# EAGLE design T2E (EAGLE 9.6.2)
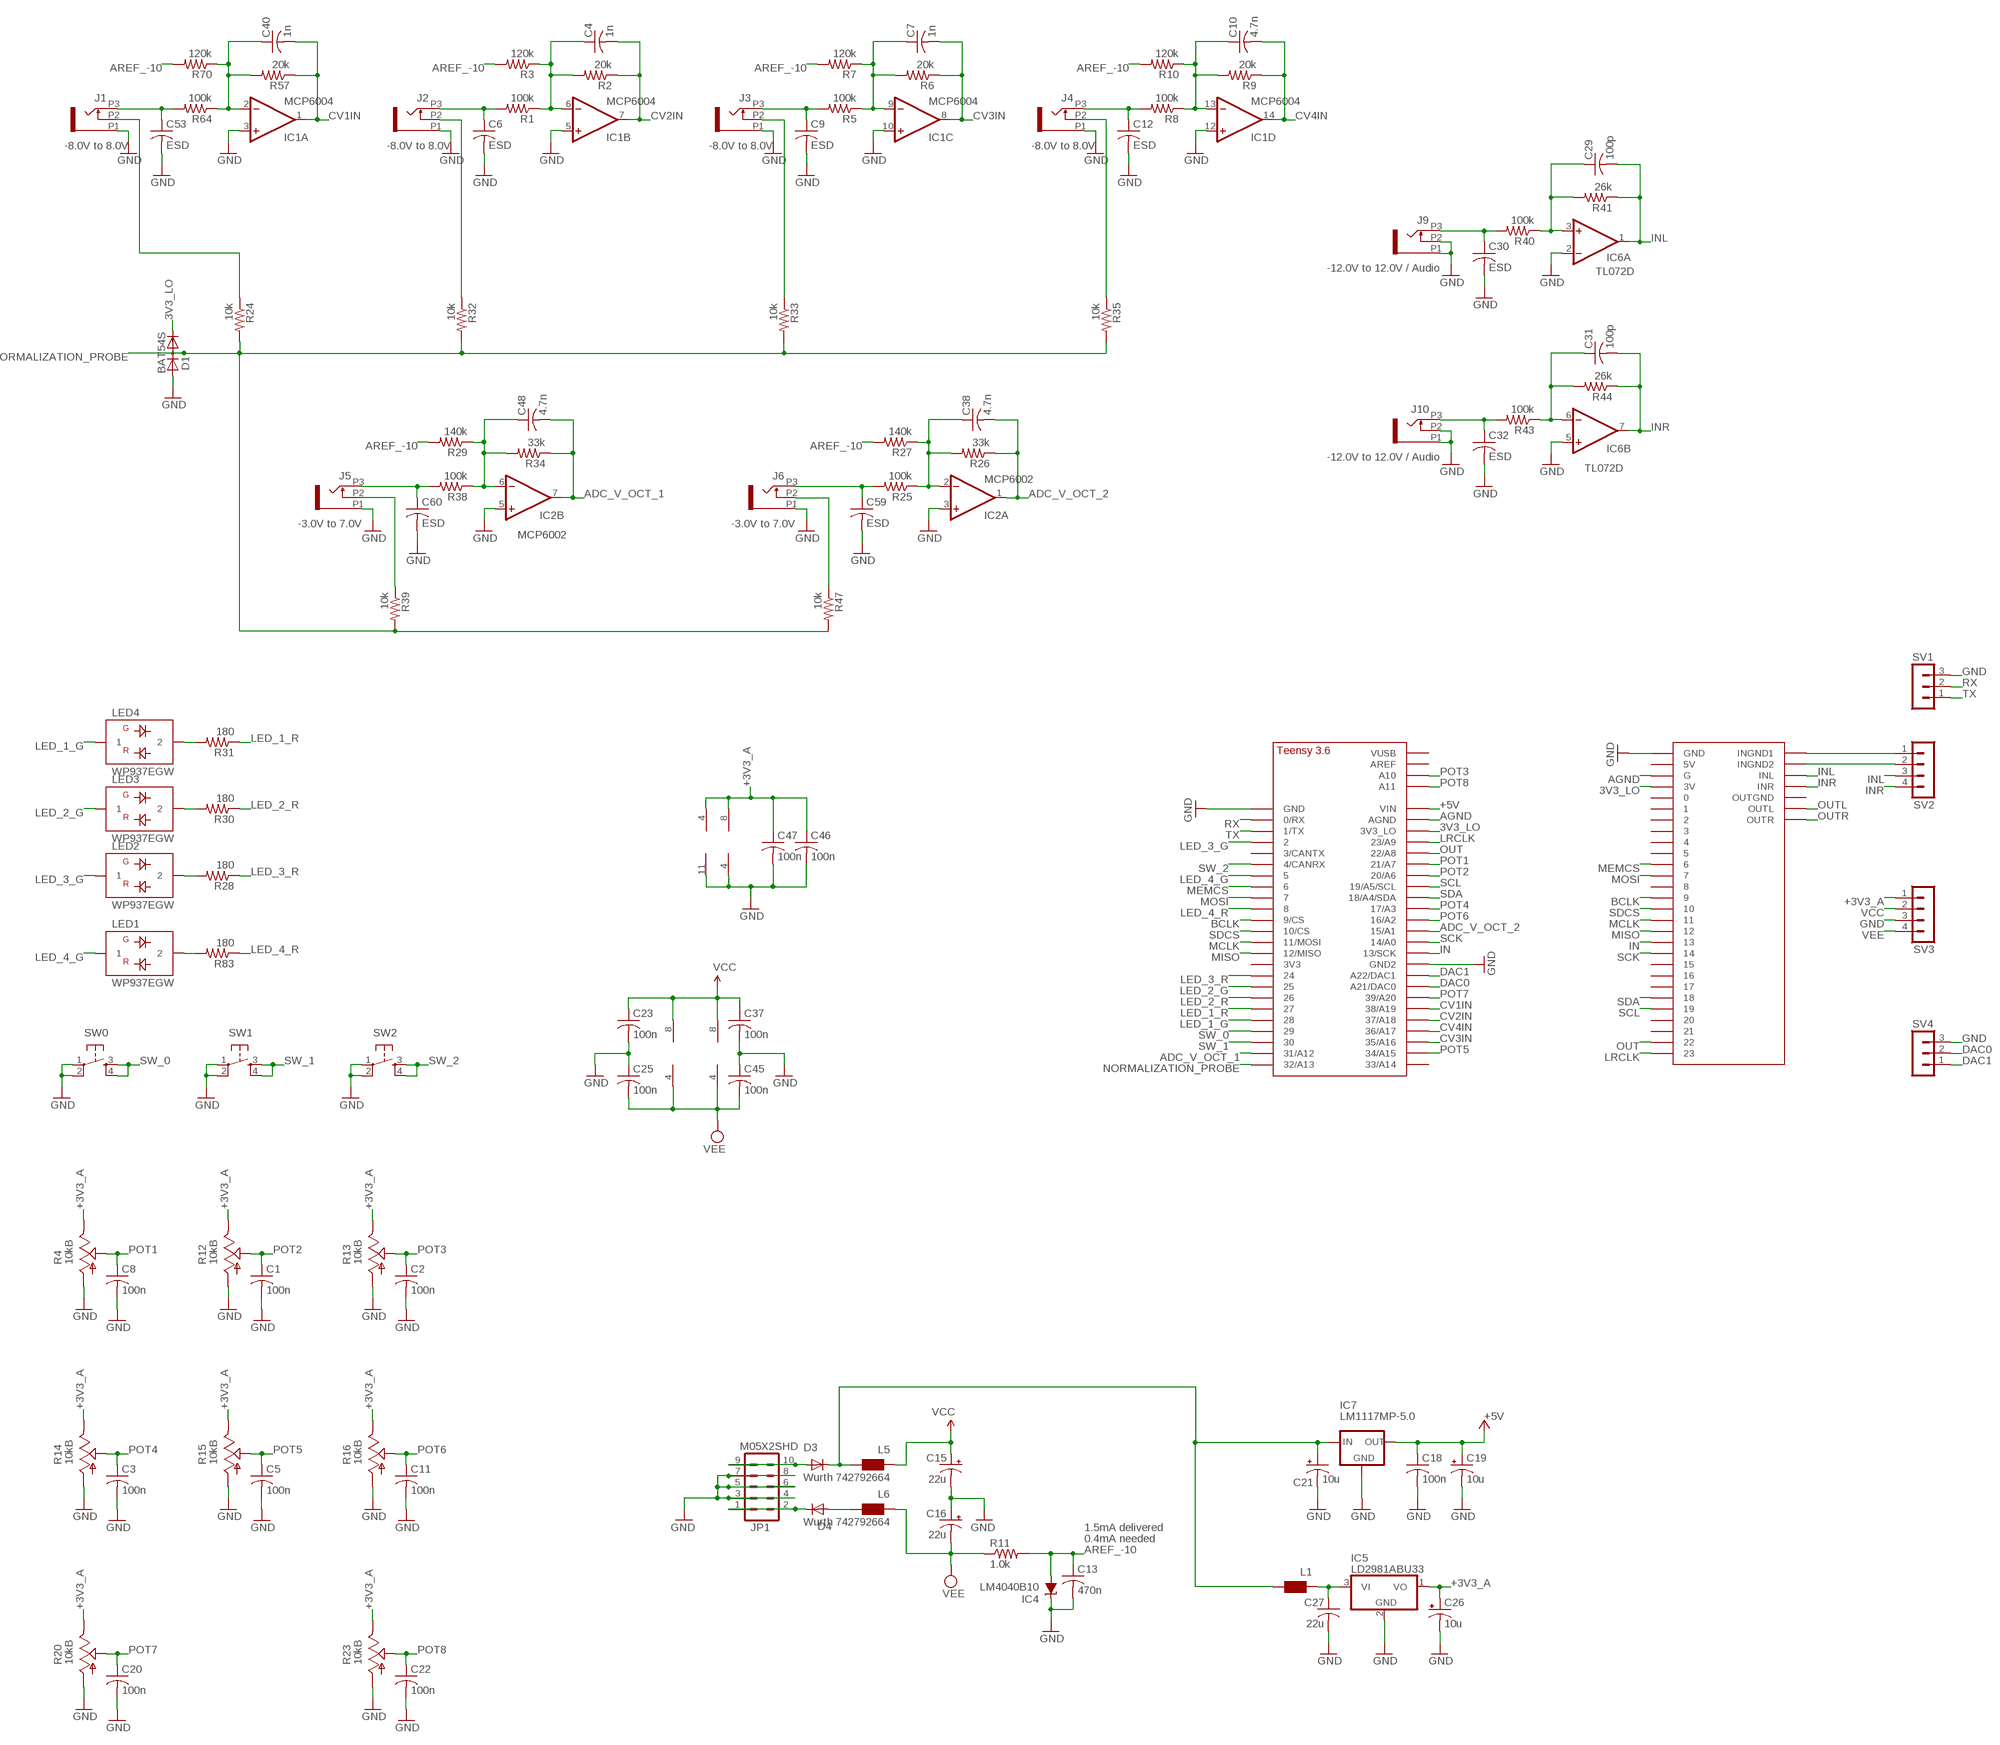
[diagram p0: schematic, sheet 1, part 1 of 2]
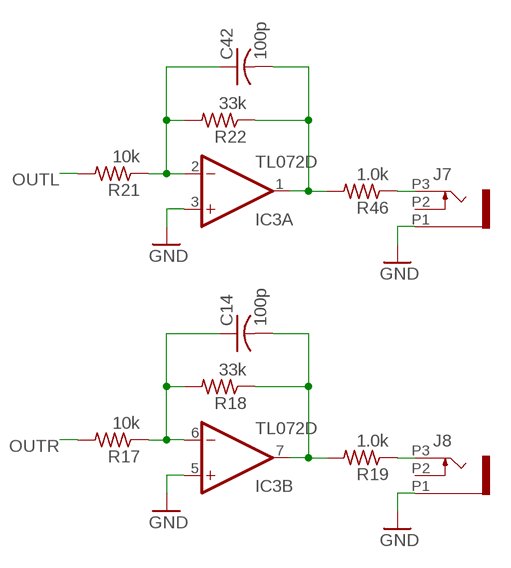
[diagram p1: schematic, sheet 1, part 2 of 2]

## Parts
C1  100n  C-USC0603  [C0603]
C2  100n  C-USC0603  [C0603]
C3  100n  C-USC0603  [C0603]
C4  1n  C-USC0603  [C0603]
C5  100n  C-USC0603  [C0603]
C6  ESD  C-USC0603  [C0603]
C7  1n  C-USC0603  [C0603]
C8  100n  C-USC0603  [C0603]
C9  ESD  C-USC0603  [C0603]
C10  4.7n  C-USC0603  [C0603]
C11  100n  C-USC0603  [C0603]
C12  ESD  C-USC0603  [C0603]
C13  470n  C-USC0603  [C0603]
C14  100p  C-USC0603  [C0603]
C15  22u  CPOL-USC  [PANASONIC_C]
C16  22u  CPOL-USC  [PANASONIC_C]
C18  100n  C-USC0603  [C0603]
C19  10u  CPOL-USC  [PANASONIC_C]
C20  100n  C-USC0603  [C0603]
C21  10u  CPOL-USC  [PANASONIC_C]
C22  100n  C-USC0603  [C0603]
C23  100n  C-USC0603  [C0603]
C25  100n  C-USC0603  [C0603]
C26  10u  CPOL-USA  [PANASONIC_A]
C27  22u  C-USC1206  [C1206]
C29  100p  C-USC0603  [C0603]
C30  ESD  C-USC0603  [C0603]
C31  100p  C-USC0603  [C0603]
C32  ESD  C-USC0603  [C0603]
C37  100n  C-USC0603  [C0603]
C38  4.7n  C-USC0603  [C0603]
C40  1n  C-USC0603  [C0603]
C42  100p  C-USC0603  [C0603]
C45  100n  C-USC0603  [C0603]
C46  100n  C-USC0603  [C0603]
C47  100n  C-USC0603  [C0603]
C48  4.7n  C-USC0603  [C0603]
C53  ESD  C-USC0603  [C0603]
C59  ESD  C-USC0603  [C0603]
C60  ESD  C-USC0603  [C0603]
D1  BAT54S  DIODE_2CACA-SOT23  [SOT23]
D3  1N5819HW  DIODE-SOD123  [SOD123]
D4  1N5819HW  DIODE-SOD123  [SOD123]
IC1  MCP6004  TL074D  [SO14]
IC2  MCP6002  TL072D  [SO08]
IC3  TL072D  [SO08]
IC4  LM4040B10  LM4041B12DBZ  [DBZ_R-PDSO-G3]
IC5  LD2981ABU33  LD2981ABU  [SOT89]
IC6  TL072D  [SO08]
IC7  LM1117MP-5.0  [SOT223]
J1  PJ301_THONKICONN6  [WQP_PJ_301M6]
J2  PJ301_THONKICONN6  [WQP_PJ_301M6]
J3  PJ301_THONKICONN6  [WQP_PJ_301M6]
J4  PJ301_THONKICONN6  [WQP_PJ_301M6]
J5  PJ301_THONKICONN6  [WQP_PJ_301M6]
J6  PJ301_THONKICONN6  [WQP_PJ_301M6]
J7  PJ301_THONKICONN6  [WQP_PJ_301M6]
J8  PJ301_THONKICONN6  [WQP_PJ_301M6]
J9  PJ301_THONKICONN6  [WQP_PJ_301M6]
J10  PJ301_THONKICONN6  [WQP_PJ_301M6]
JP1  M05X2SHD  [2X5-SHROUDED]
L1  WE-CBF_0603  [0603]
L5  Wurth 742792664  WE-CBF_0603  [0603]
L6  Wurth 742792664  WE-CBF_0603  [0603]
LED1  WP937EGW  LED-BICOLOR-SHARED-THROUGHHOLE  [LED3MM]
LED2  WP937EGW  LED-BICOLOR-SHARED-THROUGHHOLE  [LED3MM]
LED3  WP937EGW  LED-BICOLOR-SHARED-THROUGHHOLE  [LED3MM]
LED4  WP937EGW  LED-BICOLOR-SHARED-THROUGHHOLE  [LED3MM]
R1  100k  R-US_R0603  [R0603]
R2  20k  R-US_R0603  [R0603]
R3  120k  R-US_R0603  [R0603]
R4  10kB  POT_USVERTICAL_PS  [ALPS_POT_VERTICAL_PS]
R5  100k  R-US_R0603  [R0603]
R6  20k  R-US_R0603  [R0603]
R7  120k  R-US_R0603  [R0603]
R8  100k  R-US_R0603  [R0603]
R9  20k  R-US_R0603  [R0603]
R10  120k  R-US_R0603  [R0603]
R11  1.0k  R-US_R0603  [R0603]
R12  10kB  POT_USVERTICAL_PS  [ALPS_POT_VERTICAL_PS]
R13  10kB  POT_USVERTICAL_PS  [ALPS_POT_VERTICAL_PS]
R14  10kB  POT_USVERTICAL_PS  [ALPS_POT_VERTICAL_PS]
R15  10kB  POT_USVERTICAL_PS  [ALPS_POT_VERTICAL_PS]
R16  10kB  POT_USVERTICAL_PS  [ALPS_POT_VERTICAL_PS]
R17  10k  R-US_R0603  [R0603]
R18  33k  R-US_R0603  [R0603]
R19  1.0k  R-US_R0603  [R0603]
R20  10kB  POT_USVERTICAL_PS  [ALPS_POT_VERTICAL_PS]
R21  10k  R-US_R0603  [R0603]
R22  33k  R-US_R0603  [R0603]
R23  10kB  POT_USVERTICAL_PS  [ALPS_POT_VERTICAL_PS]
R24  10k  R-US_R0603  [R0603]
R25  100k  R-US_R0603  [R0603]
R26  33k  R-US_R0603  [R0603]
R27  140k  R-US_R0603  [R0603]
R28  180  R-US_R0603  [R0603]
R29  140k  R-US_R0603  [R0603]
R30  180  R-US_R0603  [R0603]
R31  180  R-US_R0603  [R0603]
R32  10k  R-US_R0603  [R0603]
R33  10k  R-US_R0603  [R0603]
R34  33k  R-US_R0603  [R0603]
R35  10k  R-US_R0603  [R0603]
R38  100k  R-US_R0603  [R0603]
R39  10k  R-US_R0603  [R0603]
R40  100k  R-US_R0603  [R0603]
R41  26k  R-US_R0603  [R0603]
R43  100k  R-US_R0603  [R0603]
R44  26k  R-US_R0603  [R0603]
R46  1.0k  R-US_R0603  [R0603]
R47  10k  R-US_R0603  [R0603]
R57  20k  R-US_R0603  [R0603]
R64  100k  R-US_R0603  [R0603]
R70  120k  R-US_R0603  [R0603]
R83  180  R-US_R0603  [R0603]
SV1  MA03-1  [MA03-1]
SV2  MA04-1  [MA04-1]
SV3  MA04-1  [MA04-1]
SV4  MA03-1  [MA03-1]
SW0  TAC_SWITCHPTH  [TACTILE-PTH]
SW1  TAC_SWITCHPTH  [TACTILE-PTH]
SW2  TAC_SWITCHPTH  [TACTILE-PTH]
U$1  TeensyAudioShield Rev C.  AUDIOSHIELD  [AUDIOSHIELD]
U$4  TEENSY_3.5/3.6_BASIC  [TEENSY_3.5/3.6_BASIC]

## Nets
3V3_LO: D1.2(C) U$1.3V U$4.3V3_LO
+3V3_A [Supply]: C26.+ C46.1 C47.1 IC1.4(P:V+) IC2.8(P:V+) IC5.1(VO) R4.P$1(E) R12.P$1(E) R13.P$1(E) R14.P$1(E) R15.P$1(E) R16.P$1(E) R20.P$1(E) R23.P$1(E) SV3.1
+5V [Supply]: C18.1 C19.+ IC7.2(OUT) IC7.4(OUT) U$4.VIN
ADC_V_OCT_1: C48.2 IC2.7(B:OUT) R34.1 U$4.31/A12
ADC_V_OCT_2: C38.2 IC2.1(A:OUT) R26.1 U$4.15/A1
AGND: U$1.G U$4.AGND
AREF_-10: C13.1 IC4.2(A) R3.2 R7.2 R10.2 R11.2 R27.2 R29.2 R70.2
BCLK: U$1.9 U$4.9/CS
CV1IN: C40.2 IC1.1(A:OUT) R57.1 U$4.38/A19
CV2IN: C4.2 IC1.7(B:OUT) R2.1 U$4.37/A18
CV3IN: C7.2 IC1.8(C:OUT) R6.1 U$4.35/A16
CV4IN: C10.2 IC1.14(D:OUT) R9.1 U$4.36/A17
DAC0: SV4.2 U$4.21/DAC0(A21/DAC0)
DAC1: SV4.1 U$4.A22/DAC1
GATE_IN1: C59.1 J6.P3 R25.2
GND [Supply]: C1.2 C2.2 C3.2 C5.2 C6.2 C8.2 C9.2 C11.2 C12.2 C13.2 C15.- C16.+ C18.2 C19.- C20.2 C21.- C22.2 C23.2 C25.1 C26.- C27.2 C30.2 C32.2 C37.2 C45.1 C46.2 C47.2 C53.2 C59.2 C60.2 D1.1(A) IC1.3(A:+IN) IC1.5(B:+IN) IC1.10(C:+IN) IC1.11(P:V-) IC1.12(D:+IN) IC2.3(A:+IN) IC2.4(P:V-) IC2.5(B:+IN) IC3.3(A:+IN) IC3.5(B:+IN) IC4.1(C) IC5.2(GND) IC6.2(A:-IN) IC6.5(B:+IN) IC7.1(GND) J1.P1 J2.P1 J3.P1 J4.P1 J5.P1 J6.P1 J7.P1 J8.P1 J9.P1 J9.P2 J10.P1 J10.P2 JP1.3 JP1.4 JP1.5 JP1.6 JP1.7 JP1.8 R4.P$3(A) R12.P$3(A) R13.P$3(A) R14.P$3(A) R15.P$3(A) R16.P$3(A) R20.P$3(A) R23.P$3(A) SV1.3 SV3.3 SV4.3 SW0.1 SW0.2 SW1.1 SW1.2 SW2.1 SW2.2 U$1.GND U$4.GND U$4.GND2
IN: U$1.13 U$4.13/SCK
INL: C29.2 IC6.1(A:OUT) R41.1 SV2.3 U$1.INL
INR: C31.2 IC6.7(B:OUT) R44.1 SV2.4 U$1.INR
LED_1_G: LED4.1 U$4.28
LED_1_R: R31.1 U$4.27
LED_2_G: LED3.1 U$4.25
LED_2_R: R30.1 U$4.26
LED_3_G: LED2.1 U$4.2
LED_3_R: R28.1 U$4.24
LED_4_G: LED1.1 U$4.5
LED_4_R: R83.1 U$4.8
LRCLK: U$1.23 U$4.23/A9
MCLK: U$1.11 U$4.11/MOSI
MEMCS: U$1.6 U$4.6
MISO: U$1.12 U$4.12/MISO
MORPH_IN: C53.1 J1.P3 R64.2
MORPH_IN1: C6.1 J2.P3 R1.2
MORPH_IN2: C9.1 J3.P3 R5.2
MORPH_IN3: C12.1 J4.P3 R8.2
MORPH_IN4: C30.1 J9.P3 R40.2
MORPH_IN5: C32.1 J10.P3 R43.2
MOSI: U$1.7 U$4.7
N$1: C4.1 IC1.6(B:-IN) R1.1 R2.2 R3.1
N$2: C7.1 IC1.9(C:-IN) R5.1 R6.2 R7.1
N$3: C10.1 IC1.13(D:-IN) R8.1 R9.2 R10.1
N$4: C14.1 IC3.6(B:-IN) R17.1 R18.2
N$5 [Supply]: D3.A JP1.9 JP1.10
N$6: C14.2 IC3.7(B:OUT) R18.1 R19.2
N$7 [Supply]: D4.C JP1.1 JP1.2
N$8: J8.P3 R19.1
N$10: SV2.1 U$1.INGND1
N$11: C40.1 IC1.2(A:-IN) R57.2 R64.1 R70.1
N$12 [Supply]: D4.A L6.2
N$14: C38.1 IC2.2(A:-IN) R25.1 R26.2 R27.1
N$15: SV2.2 U$1.INGND2
N$16: C29.1 IC6.3(A:+IN) R40.1 R41.2
N$17: LED2.2 R28.2
N$18 [Supply]: J5.P2 R39.1
N$19: LED3.2 R30.2
N$20: LED4.2 R31.2
N$21: C31.1 IC6.6(B:-IN) R43.1 R44.2
N$24 [Supply]: J3.P2 R33.1
N$25: J2.P2 R32.1
N$26: J1.P2 R24.1
N$27 [Supply]: J4.P2 R35.1
N$30: C48.1 IC2.6(B:-IN) R29.1 R34.2 R38.1
N$31 [Supply]: J6.P2 R47.1
N$40: C21.+ D3.C IC7.3(IN) L1.2 L5.2
N$42: C27.1 IC5.3(VI) L1.1
N$44: LED1.2 R83.2
N$62: C42.1 IC3.2(A:-IN) R21.1 R22.2
N$63: C42.2 IC3.1(A:OUT) R22.1 R46.2
N$65: J7.P3 R46.1
NORMALIZATION_PROBE: D1.3(AC) R24.2 R32.2 R33.2 R35.2 R39.2 R47.2 U$4.32/A13
OUT: U$1.22 U$4.22/A8
OUTL: R21.2 U$1.OUTL
OUTR: R17.2 U$1.OUTR
POT1: C8.1 R4.P$2(S) U$4.21/A7
POT2: C1.1 R12.P$2(S) U$4.20/A6
POT3: C2.1 R13.P$2(S) U$4.A10
POT4: C3.1 R14.P$2(S) U$4.17/A3
POT5: C5.1 R15.P$2(S) U$4.34/A15
POT6: C11.1 R16.P$2(S) U$4.16/A2
POT7: C20.1 R20.P$2(S) U$4.39/A20
POT8: C22.1 R23.P$2(S) U$4.A11
RX: SV1.2 U$4.0/RX
SCK: U$1.14 U$4.14/A0
SCL: U$1.19 U$4.19/A5/SCL
SDA: U$1.18 U$4.18/A4/SDA
SDCS: U$1.10 U$4.10/CS
SW_0: SW0.3 SW0.4 U$4.29
SW_1: SW1.3 SW1.4 U$4.30
SW_2: SW2.3 SW2.4 U$4.4/CANRX
TX: SV1.1 U$4.1/TX
V_OCT_IN: C60.1 J5.P3 R38.2
VCC [Supply]: C15.+ C23.1 C37.1 IC3.8(P:V+) IC6.8(P:V+) L5.1 SV3.2
VEE [Supply]: C16.- C25.2 C45.2 IC3.4(P:V-) IC6.4(P:V-) L6.1 R11.1 SV3.4
Unconnected: J7.P2 J8.P2 U$1.0 U$1.1 U$1.2 U$1.3 U$1.4 U$1.5 U$1.5V U$1.8 U$1.15 U$1.16 U$1.17 U$1.20 U$1.21 U$1.OUTGND U$4.3/CANTX U$4.3V3 U$4.33/A14 U$4.AREF U$4.VUSB

## Notes on the sheet
- -8.0V to 8.0V | -8.0V to 8.0V | -8.0V to 8.0V | -8.0V to 8.0V
- -12.0V to 12.0V / Audio
- -12.0V to 12.0V / Audio
- -3.0V to 7.0V | -3.0V to 7.0V
- 1.5mA delivered
- 0.4mA needed

## Library data of the parts
C1-C14 C18 C20 C22 C23 C25 C27 C29-C32 C37 C38 C40 C42 C45-C48 C53 C59 C60 = rcl:C-US: CAPACITOR, American symbol
C15 C16 C19 C21 C26 = rcl:CPOL-US: POLARIZED CAPACITOR, American symbol
D1 = diode:DIODE_2CACA-: 2 Diodes - Cathode-Anode|Cathode-Anode
D3 D4 = diode:DIODE-: DIODE
IC1 = og-linear:TL074: OP AMP
IC2 IC3 IC6 = og-linear:TL072: OP AMP
IC4 = texas:LM4041: PRECISION MICROPOWER SHUNT VOLTAGE REFERENCE Source: http://focus.ti.com/lit/ds/slcs146e/slcs146e.pdf
IC5 = og-vreg:LD2981
IC7 = lm1117:LM1117?-*: 800mA Low-Dropout Linear Regulator Source: http://ww1.microchip.com/downloads/en/DeviceDoc/39760d.pdf; MF: Texas Instruments; MPN: LM1117MP-5.0; OC_FARNELL: 9778209; OC_NEWARK: 28X3417
J1-J4 J9 J10 = og-pj301:PJ301_THONKICONN
J5-J8 = og-pj301_variations:PJ301_THONKICONN
JP1 = og-header:M05X2: Header 5x2 Standard 10-pin dual row 0.1" header. Commonly used with AVR-ISP. Use with Spark Fun Electronics SKU: PRT-00778
L1 L5 L6 = wuerth-elektronik:WE-CBF: SMD EMI Suppression Ferrite Beads - excellent anti-EMI properties - low DCR - impedances till 3000 ohms - rated current up to 6 A
LED1-LED4 = og-leds:LED-BICOLOR-SHARED-THROUGHHOLE
R1-R3 R5-R11 R17-R19 R21 R22 R24-R35 R38-R41 R43 R44 R46 R47 R57 R64 R70 R83 = rcl:R-US_: RESISTOR, American symbol
R4 R12-R16 R20 R23 = og-pots:POT_US
SV1 SV4 = con-lstb:MA03-1: PIN HEADER; OC_FARNELL: unknown; OC_NEWARK: unknown
SV2 SV3 = con-lstb:MA04-1: PIN HEADER; OC_FARNELL: unknown; OC_NEWARK: unknown
SW0 SW1 SW2 = SparkFun:TAC_SWITCH: Momentary Switch Button commonly used for reset or general input. Spark Fun Electronics SKU : COM-00097
U$1 = Teensy_Audioshield:AUDIOSHIELD: Teensy 3 Audioshield by PJRC.COM
U$4 = Teensy356:TEENSY_3.5/3.6_BASIC

## Net classes
0 default: width 0.203 mm, clearance 0.203 mm
1 Supply: width 0.406 mm, clearance 0.203 mm

## Board
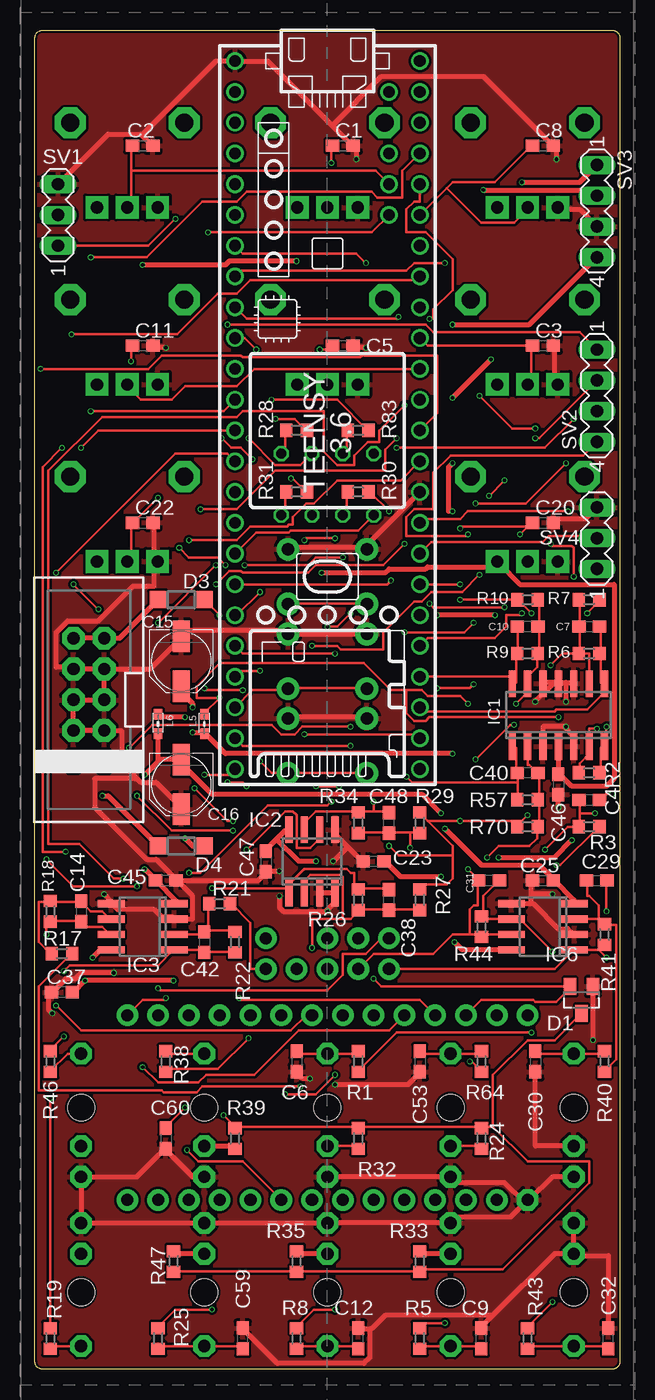
[diagram p2: board, top side]
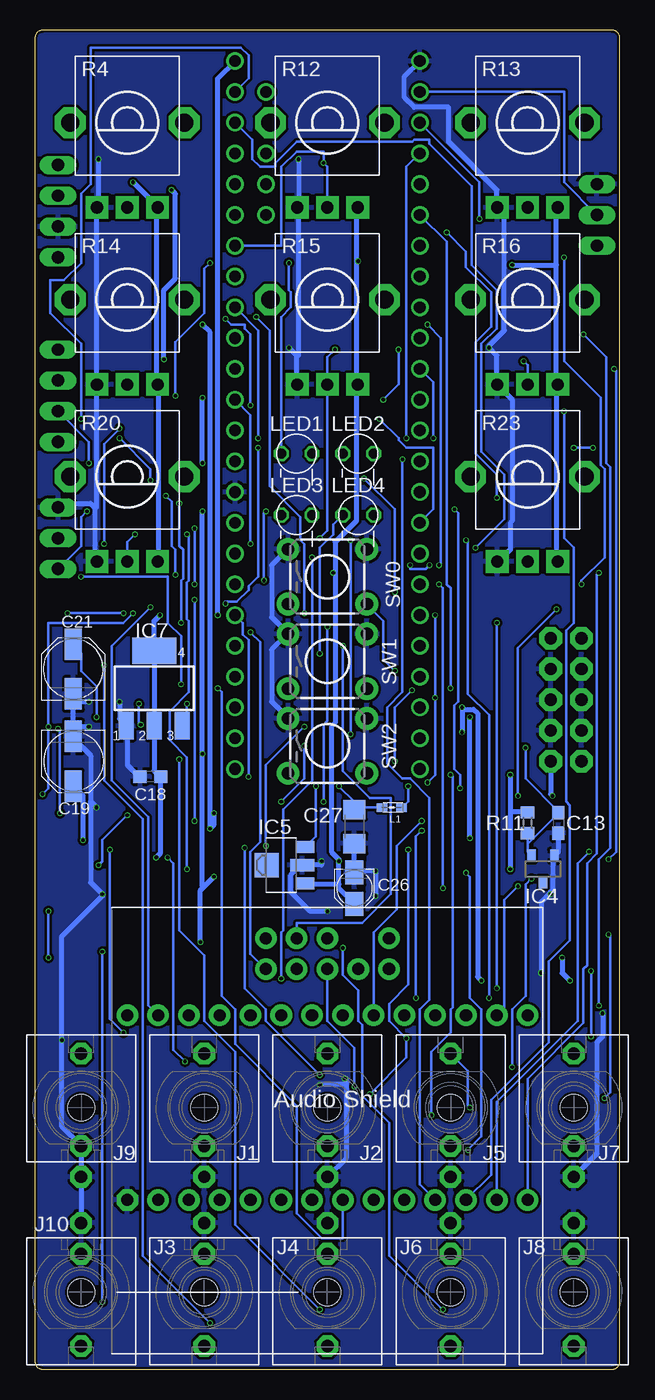
[diagram p3: board, bottom side, seen from below]

Size 48.26 x 110.49 mm. Coordinates in mm from the lower left corner, seen from the top.
Copper layers (1*16): Top 0.035559375mm / dielectric 1.6mm / Bottom 0.035559375mm
Design rules "jlcpcb2layer *": minimum track width 5mil, minimum drill 12mil, track to track 5mil, track to pad 5mil, pad to pad 5mil, via to via 5mil, smd to smd 5mil, copper to edge 8mil, drill to drill 6mil, minimum pad ring 5mil, minimum via ring 3mil, stop-mask expansion 2.5mil, vias tented up to drill 0mil, thermal gap 10mil

### Footprints (pad centres in the part's own frame; a part is rotated, then mirrored left to right if it is on the bottom)
C0603 = smd 1.1 x 1: 1 -0.85,0; 2 0.85,0
PANASONIC_C = smd 2.6 x 1.4: + 2.05,0; - -2.05,0
PANASONIC_A = smd 2 x 1.5: + 1.3,0; - -1.3,0
C1206 = smd 1.6 x 1.8: 1 -1.4,0; 2 1.4,0
SOT23 = smd 1 x 1.4: 1 -0.95,-1.1; 2 0.95,-1.1; 3 0,1.1
SOD123 = smd 1.4 x 1.4: A 1.9,0; C -1.9,0
SO14 = smd 0.6 x 2.2: 1 -3.81,-2.6; 2 -2.54,-2.6; 3 -1.27,-2.6; 4 0,-2.6; 5 1.27,-2.6; 6 2.54,-2.6; 7 3.81,-2.6; 8 3.81,2.6; 9 2.54,2.6; 10 1.27,2.6; 11 0,2.6; 12 -1.27,2.6; 13 -2.54,2.6; 14 -3.81,2.6
SO08 = smd 0.6 x 2.2: 1 -1.905,-2.6; 2 -0.635,-2.6; 3 0.635,-2.6; 4 1.905,-2.6; 5 1.905,2.6; 6 0.635,2.6; 7 -0.635,2.6; 8 -1.905,2.6
DBZ_R-PDSO-G3 = smd 0.7 x 1: 1 -0.95,-1.1; 2 0.95,-1.1; 3 0,1.1
SOT89 = smd 1 x 1.5: 1 -1.499,-1.981; 3 1.499,-1.981 | smd 1 x 2: 2 0,-1.727 | smd 2 x 2: 2@1 0,1.194
SOT223 = smd 1.219 x 2.235: 1 -2.311,-3.099; 2 0,-3.099; 3 2.311,-3.099 | smd 3.6 x 2.2: 4 0,3.099
WQP_PJ_301M6 = drill 1.016 pad 1.778 octagon: P1 0,-5.715; P2 0,-3.175; P3 0,4.445 | hole 2.2: 0,0
2X5-SHROUDED = drill 1.016 pad 1.88 octagon: 1 -1.27,5.08; 2 1.27,5.08; 3 -1.27,2.54; 4 1.27,2.54; 5 -1.27,0; 6 1.27,0; 7 -1.27,-2.54; 8 1.27,-2.54; 9 -1.27,-5.08; 10 1.27,-5.08
0603 = smd 0.85 x 0.7: 1 -0.9,0; 2 0.7,0
LED3MM = drill 0.813 octagon: 1 -1.27,0; 2 1.27,0
R0603 = smd 1 x 1.1: 1 -0.85,0; 2 0.85,0
ALPS_POT_VERTICAL_PS = drill 1 pad 1.88 square: P$1 -2.5,7; P$2 0,7; P$3 2.5,7 | drill 1.5 pad 2.54 octagon: P$4 -4.7,0; P$5 4.7,0
MA03-1 = drill 1.016 long: 1 -2.54,0; 2 0,0; 3 2.54,0
MA04-1 = drill 1.016 long: 1 -3.81,0; 2 -1.27,0; 3 1.27,0; 4 3.81,0
TACTILE-PTH = drill 1.016 pad 1.88: 1 -3.251,2.261; 2 3.251,2.261; 3 -3.251,-2.261; 4 3.251,-2.261
AUDIOSHIELD = drill 1 pad 1.778: 0 -13.97,-5.08; 1 -11.43,-5.08; 2 -8.89,-5.08; 3 -6.35,-5.08; 3V -11.43,10.16; 4 -3.81,-5.08; 5 -1.27,-5.08; 5V -16.51,10.16; 6 1.27,-5.08; 7 3.81,-5.08; 8 6.35,-5.08; 9 8.89,-5.08; 10 11.43,-5.08; 11 13.97,-5.08; 12 16.51,-5.08; 13 16.51,10.16; 14 13.97,10.16; 15 11.43,10.16; 16 8.89,10.16; 17 6.35,10.16; 18 3.81,10.16; 19 1.27,10.16; 20 -1.27,10.16; 21 -3.81,10.16; 22 -6.35,10.16; 23 -8.89,10.16; G -13.97,10.16; INGND1 -5.08,16.51; INGND2 -2.54,16.51; INL -5.08,13.97; INR -2.54,13.97; OUTGND 2.54,13.97; OUTL 5.08,13.97; OUTR 0,13.97; UNUSED1 0,16.51; UNUSED2 5.08,16.51 | drill 1 pad 1.778 octagon: GND -16.51,-5.08
TEENSY_3.5/3.6_BASIC = drill 0.965: 0/RX -25.4,-7.62; 1/TX -22.86,-7.62; 2 -20.32,-7.62; 3/CANTX -17.78,-7.62; 3V3 7.62,-7.62; 3V3_LO -22.86,7.62; 4/CANRX -15.24,-7.62; 5 -12.7,-7.62; 6 -10.16,-7.62; 7 -7.62,-7.62; 8 -5.08,-7.62; 9/CS -2.54,-7.62; 10/CS 0,-7.62; 11/MOSI 2.54,-7.62; 12/MISO 5.08,-7.62; 13/SCK 5.08,7.62; 14/A0 2.54,7.62; 15/A1 0,7.62; 16/A2 -2.54,7.62; 17/A3 -5.08,7.62; 18/A4/SDA -7.62,7.62; 19/A5/SCL -10.16,7.62; 20/A6 -12.7,7.62; 21/A7 -15.24,7.62; 21/DAC0 12.7,7.62; 22/A8 -17.78,7.62; 23/A9 -20.32,7.62; 24 10.16,-7.62; 25 12.7,-7.62; 26 15.24,-7.62; 27 17.78,-7.62; 28 20.32,-7.62; 29 22.86,-7.62; 30 25.4,-7.62; 31/A12 27.94,-7.62; 32/A13 30.48,-7.62; 33/A14 30.48,7.62; 34/A15 27.94,7.62; 35/A16 25.4,7.62; 36/A17 22.86,7.62; 37/A18 20.32,7.62; 38/A19 17.78,7.62; 39/A20 15.24,7.62; A10 -17.78,5.08; A11 -15.24,5.08; A22/DAC1 10.16,7.62; AGND -25.4,7.62; AREF -20.32,5.08; GND -27.94,-7.62; GND2 7.62,7.62; VIN -27.94,7.62; VUSB -25.4,5.08

### Placement (x,y rotation side)
C1  25.4,100.97 0 top
C2  8.89,100.97 0 top
C3  41.91,84.45 0 top
C4  45.72,46.99 0 top
C5  25.4,84.45 0 top
C6  21.59,25.4 270 top
C7  45.72,61.28 0 top
C8  41.91,100.97 0 top
C9  36.83,2.54 90 top
C10  40.64,61.28 180 top
C11  8.89,84.45 0 top
C12  26.67,2.54 90 top
C13  5.08,45.09 270 bottom
C14  3.81,37.78 270 top
C15  12.06,58.42 270 top
C16  12.06,48.26 270 top
C18  38.73,48.89 180 bottom
C19  45.08,50.16 270 bottom
C20  41.91,69.85 0 top
C21  45.08,57.78 90 bottom
C22  8.89,69.85 0 top
C23  27.94,41.91 180 top
C25  41.91,40.32 0 top
C26  21.91,39.69 270 bottom
C27  21.91,44.77 270 bottom
C29  46.35,40.32 0 top
C30  41.27,25.4 270 top
C31  37.46,40.32 180 top
C32  47.31,2.54 90 top
C37  2.22,31.12 180 top
C38  29.21,38.73 90 top
C40  40.64,49.21 180 top
C42  13.97,35.24 270 top
C45  10.79,40.32 180 top
C46  43.18,48.26 270 top
C47  19.05,41.91 270 top
C48  29.21,45.09 90 top
C53  31.75,25.4 270 top
C59  17.14,2.54 90 top
C60  10.79,19.05 270 top
D1  45.08,30.48 180 top
D3  12.06,63.5 180 top
D4  12.06,43.18 0 top
IC1  43.18,53.97 0 top
IC2  22.86,41.91 0 top
IC3  8.89,36.51 90 top
IC4  6.35,41.28 180 bottom
IC5  27.94,41.59 90 bottom
IC6  41.91,36.51 90 top
IC7  38.42,56.2 0 bottom
J1  34.29,21.59 0 bottom
J2  24.13,21.59 0 bottom
J3  34.29,6.35 180 bottom
J4  24.13,6.35 180 bottom
J5  13.97,21.59 0 bottom
J6  13.97,6.35 180 bottom
J7  3.81,21.59 0 bottom
J8  3.81,6.35 180 bottom
J9  44.45,21.59 0 bottom
J10  44.45,6.35 180 bottom
JP1  4.44,55.25 180 top
L1  18.73,46.36 0 bottom
L5  13.97,53.34 90 top
L6  10.16,53.34 90 top
LED1  26.67,75.56 0 bottom
LED2  21.59,75.56 0 bottom
LED3  26.67,70.48 0 bottom
LED4  21.59,70.48 0 bottom
R1  26.67,25.4 90 top
R2  45.72,49.21 180 top
R3  45.72,44.77 0 top
R4  40.64,102.87 180 bottom
R5  31.75,2.54 270 top
R6  45.72,59.06 180 top
R7  45.72,63.5 0 top
R8  21.59,2.54 270 top
R9  40.64,59.06 0 top
R10  40.64,63.5 180 top
R11  7.62,45.09 270 bottom
R12  24.13,102.87 180 bottom
R13  7.62,102.87 180 bottom
R14  40.64,88.27 180 bottom
R15  24.13,88.27 180 bottom
R16  7.62,88.27 180 bottom
R17  2.22,34.29 0 top
R18  1.27,37.78 90 top
R19  1.27,2.54 90 top
R20  40.64,73.66 180 bottom
R21  15.24,38.42 0 top
R22  16.51,35.24 90 top
R23  7.62,73.66 180 bottom
R24  36.83,19.05 90 top
R25  10.16,2.54 270 top
R26  26.67,38.73 270 top
R27  31.75,38.73 90 top
R28  21.59,77.47 180 top
R29  31.75,45.09 90 top
R30  26.67,72.39 180 top
R31  21.59,72.39 180 top
R32  26.67,19.05 90 top
R33  31.75,8.89 270 top
R34  26.67,45.09 270 top
R35  21.59,8.89 270 top
R38  10.79,25.4 90 top
R39  16.51,19.05 90 top
R40  46.99,25.4 90 top
R41  46.99,35.88 90 top
R43  40.64,2.54 270 top
R44  36.83,36.51 90 top
R46  1.27,25.4 90 top
R47  11.43,8.89 270 top
R57  40.64,46.99 0 top
R64  36.83,25.4 90 top
R70  40.64,44.77 180 top
R83  26.67,77.47 180 top
SV1  1.9,95.25 90 top
SV2  46.35,80.33 270 top
SV3  46.35,95.57 270 top
SV4  46.35,68.58 90 top
SW0  24.13,65.41 0 bottom
SW1  24.13,58.42 0 bottom
SW2  24.13,51.44 0 bottom
U$1  24.13,19.05 0 bottom
U$3  [EURO_PCB_10HP]  -1.27,-8.89 0 top  (outside the outline)
U$4  24.13,80.01 270 top

### Tracks (layer width: path | path; a pad name or v marks a point on that pad's centre or on a via)
3V3_LO  (via drill 0.3)
  Top 0.203: U$1.3V 36.83,30.48 41.12,30.48 41.27,30.32 43.02,30.32 44.13,31.43 D1.2 44.13,31.59 28.57,31.59 v27.94,32.23 | v11.91,67.79 12.7,66.99 15.08,66.99 v15.72,66.36 | v17.3,66.36 22.54,66.36 23.18,66.99 v25.4,66.99
  Bottom 0.203: U$4.3V3_LO 30.32,101.44 30.32,99.85 29.69,99.22 28.42,99.22 28.42,99.54 26.67,101.28 17.14,101.28 16.99,101.44 15.72,101.44 15.72,101.12 12.22,97.63 12.22,91.12 10.16,89.06 10.16,85.88 11.43,84.61 11.43,75.72 9.52,73.82 9.52,70.17 v11.91,67.79 | v15.72,66.36 16.03,66.04 17.3,66.04 v17.3,66.36 | v25.4,66.99 25.4,48.58 27.78,46.2 27.78,36.2 27.94,36.04 v27.94,32.23
+3V3_A  (via drill 0.3)
  Top 0.406: IC1.4 C46.1 43.34,49.05 44.29,48.1 47.15,48.1 47.78,48.74 47.78,64.77 40,64.77 38.26,66.52 R20.P$1 37.94,66.67 37.46,66.2 32.38,66.2 32.23,66.04 29.21,66.04 28.89,65.72 v23.65,65.72 | SV3.1 44.93,97.95 v40.16,97.95 | 19.92,43.74 20.64,44.45 20.95,44.45 IC2.8 | 19.92,43.74 19.05,42.86 C47.1 | 19.92,43.74 21.75,41.91 v23.18,41.91 | v8.89,91.12 15.72,91.12 16.03,91.44 v21.59,91.44
  Bottom 0.406: v40.16,97.95 38.26,96.04 38.26,95.88 R4.P$1 38.26,95.73 38.26,81.28 R14.P$1 38.1,81.12 38.1,66.67 R20.P$1 | R23.P$1 5.24,66.67 5.24,81.12 R16.P$1 5.24,81.44 5.24,91.12 | 5.24,91.12 5.24,95.73 R13.P$1 | 23.18,40 25.88,40 IC5.1 | 23.18,40 23.18,39.69 21.91,38.42 C26.+ | 23.18,40 v23.18,41.91 23.18,42.07 23.81,42.7 23.81,53.02 23.49,53.34 23.49,65.72 | 21.75,91.44 21.75,95.73 R12.P$1 | 21.75,91.44 21.75,81.28 R15.P$1 21.75,81.12 21.75,70.01 23.49,68.26 23.49,65.72 | v8.89,91.12 5.24,91.12 | v21.59,91.44 21.75,91.44 | v23.65,65.72 23.49,65.72
+5V  (via drill 0.3)
  Top 0.406: v44.29,43.66 42.86,42.23 v38.26,42.23 | v37.94,62.23 v33.18,62.23
  Bottom 0.406: v44.29,43.66 44.29,47.31 C19.+ | v38.26,42.23 37.94,42.55 37.94,48.74 C18.1 37.94,48.89 38.42,49.37 IC7.2 IC7.4 38.42,61.75 v37.94,62.23 | U$4.VIN 33.18,106.52 v33.18,62.23
ADC_V_OCT_1  (via drill 0.3)
  Top 0.203: 27.94,46.04 29.21,46.04 C48.2 | 27.94,46.04 26.67,46.04 | 26.67,46.04 23.18,46.04 22.22,45.09 IC2.7 | 26.67,46.04 R34.1 | U$4.31/A12 17.14,51.44 v26.03,51.44 | 27.94,46.04 v27.94,46.83
  Bottom 0.203: v26.03,51.44 26.03,48.74 v27.94,46.83
ADC_V_OCT_2  (via drill 0.3)
  Top 0.203: 26.67,39.69 29.21,39.69 C38.2 | 26.67,39.69 26.35,39.69 26.35,40.96 26.03,40.96 25.72,41.28 22.22,41.28 | 20.95,40 20.95,39.69 v14.6,39.69 | 26.67,39.69 R26.1 | v30.48,68.1 28.73,66.36 23.18,66.36 22.54,65.72 17.14,65.72 16.99,65.88 16.03,65.88 v14.92,64.77
  Top 0.254: IC2.1 20.95,40 22.22,41.28
  Bottom 0.203: U$4.15/A1 30.48,78.74 v30.48,68.1 | v14.92,64.77 14.6,64.45 v14.6,39.69
AGND  (via drill 0.3)
  Top 0.203: v44.45,78.42 42.07,76.04 v29.84,76.04 | v32.54,63.18 32.86,62.86 v38.73,62.86
  Bottom 0.203: U$4.AGND 30.64,106.52 30.64,108.43 31.27,109.06 43.66,109.06 43.66,97.79 44.45,97 44.45,91.28 45.88,89.85 46.99,89.85 46.99,87.15 44.45,84.61 v44.45,78.42 | v29.84,76.04 29.84,65.41 30.64,64.61 30.64,64.29 31.59,63.34 32.54,63.34 v32.54,63.18 | v38.73,62.86 41.91,59.69 41.91,48.58 38.89,45.56 38.89,30 U$1.G
AREF_-10  (via drill 0.3)
  Top 0.203: v40.96,62.39 39.85,63.5 R10.2 v35.08,63.5 | v45.56,62.39 46.67,63.5 R7.2 | 34.45,42.39 34.45,43.18 32.38,45.24 | 34.45,42.39 34.45,40.48 33.97,40 32.07,40 31.75,39.69 R27.2 | 32.38,45.24 31.75,45.88 R29.2 | 39.69,44.77 39.21,45.24 v35.08,45.24 32.38,45.24 | v43.02,41.59 43.34,41.59 46.51,44.77 R3.2 | 39.69,44.77 v40.64,45.72 | 39.69,44.77 R70.2 | v7.78,51.28 9.68,53.18 19.53,53.18 20.32,52.39 21.43,52.39 22.07,53.02 v26.03,53.02 | v29.21,43.18 30,42.39 34.45,42.39
  Bottom 0.203: v45.56,62.39 v40.96,62.39 | R11.2 7.62,43.34 | 7.62,43.34 7.62,42.7 IC4.2 | 7.62,43.34 5.08,45.88 C13.1 5.08,46.04 7.78,48.74 v7.78,51.28 | v43.02,41.59 42.7,41.91 42.7,43.66 v40.64,45.72 | v26.03,53.02 29.21,49.85 v29.21,43.18 | v35.08,45.24 v35.08,63.5
BCLK  (via drill 0.3)
  Top 0.203: v15.4,76.83 16.19,76.04 16.99,76.04 v17.94,75.09
  Bottom 0.203: U$4.9/CS 15.4,81.44 v15.4,76.83 | v17.94,75.09 17.94,55.88 19.21,54.61 19.21,50.01 17.94,48.74 17.3,48.74 15.72,47.15 15.72,30.48 16.51,29.69 16.51,15.24 U$1.9
CV1IN  (via drill 0.3)
  Top 0.203: 39.85,48.42 39.85,49.21 C40.2 39.69,49.21 39.69,51.28 39.37,51.28 IC1.1 | 39.85,48.42 39.85,46.99 R57.1 | v30.64,48.89 31.11,48.42 39.85,48.42
  Bottom 0.203: U$4.38/A19 31.11,61.59 31.11,60.64 30.64,60.17 v30.64,48.89
CV2IN  (via drill 0.3)
  Top 0.203: v47.62,47.47 47.15,47.47 46.67,46.99 C4.2 | v47.15,53.02 47.15,51.44 46.99,51.44 IC1.7 46.99,51.28 46.67,51.28 46.67,49.21 R2.1 | U$4.37/A18 32.38,60.33 37.94,60.33 38.89,61.28 38.89,62.23 40,62.23 v40.16,62.39
  Bottom 0.203: v47.62,47.47 47.15,47.94 v47.15,53.02 47.15,61.59 40.96,61.59 v40.16,62.39
CV3IN
  Top 0.203: 46.67,59.06 46.67,61.28 C7.2 | 46.67,59.06 46.67,56.67 46.99,56.67 IC1.8 46.99,55.88 45.56,54.45 43.02,54.45 42.86,54.29 32.07,54.29 U$4.35/A16 | 46.67,59.06 R6.1
CV4IN
  Top 0.203: C10.2 39.85,61.28 39.85,59.06 R9.1 39.69,59.06 39.69,57.15 | 39.69,57.15 39.69,56.67 39.37,56.67 IC1.14 | 39.69,57.15 U$4.36/A17
DAC0
  Top 0.203: U$4.21/DAC0 32.7,68.26 41.91,68.26 42.39,68.74 46.2,68.74 SV4.2
DAC1  (via drill 0.3)
  Top 0.203: U$4.A22/DAC1 32.07,70.17 35.08,70.17 35.72,70.8 v43.97,70.8
  Bottom 0.203: v43.97,70.8 44.45,70.33 44.45,67.95 SV4.1
GATE_IN1
  Top 0.203: R25.2 10.16,1.75 10.32,1.91 J6.P3 16.99,1.91 17.14,1.75 C59.1
GND  (via drill 0.3)
  Top 0.406: 27.62,3.33 27.62,0.95 27.15,0.48 20,0.48 17.14,3.33 C59.2 | 27.62,3.33 26.67,3.33 C12.2 | 37.7,4.37 42.86,9.53 J10.P2 | 37.7,4.37 36.83,3.49 C9.2 | C32.2 47.31,9.37 44.45,9.37 J10.P2 | J10.P2 J10.P1 | 27.62,3.33 27.78,3.33 28.89,4.45 37.62,4.45 37.7,4.37 | J5.P1 13.02,15.88 10.79,18.1 C60.2 10.64,18.1 8.41,15.88 J7.P1 J8.P1 J6.P1 J4.P1 J3.P1 34.77,12.54 39.21,12.54 U$1.GND | 40.96,38.42 40.96,39.21 | 40.96,39.21 40.96,40.32 C25.1 | IC6.5 40.96,38.42 | IC6.2 44.45,35.88 43.97,36.35 43.18,36.35 41.12,38.42 40.96,38.42 | IC1.3 41.91,53.02 43.66,53.02 | 43.66,53.02 44.45,52.23 IC1.5 | 42.7,56.67 43.18,56.67 IC1.11 43.34,56.67 43.81,56.67 | 42.7,56.67 41.91,56.67 IC1.12 | 43.81,56.67 44.45,56.67 IC1.10 | v43.18,46.36 C46.2 | v43.81,55.09 43.81,56.67 | v43.81,53.02 43.66,53.02 | v41.27,55.09 42.7,56.52 42.7,56.67 | v42.7,39.21 40.96,39.21 | v22.7,23.97 22.07,23.97 21.59,24.45 C6.2 | v24.76,23.5 30.8,23.5 31.75,24.45 C53.2 | U$1.GND 40.32,13.81 38.73,15.4 34.77,15.4 J1.P1 J2.P1 | C30.2 41.27,18.41 J9.P2 | v46.04,27.15 46.04,31.43 D1.1 | J9.P1 42.7,15.88 40.8,13.97 U$1.GND | SV3.3 44.93,95.73 43.18,95.73 R4.P$3 | C3.2 42.86,84.45 42.86,81.28 43.02,81.28 R14.P$3 | SV4.3 45.4,70.17 43.18,70.17 42.86,69.85 C20.2 | v27.3,84.3 26.51,84.3 26.35,84.45 C5.2 | 8.81,101.84 8.73,101.92 6.03,101.92 SV1.3 | 8.81,101.84 9.68,100.97 C2.2 | 24.53,102.63 19.21,107.95 U$4.GND 14.92,107.95 8.81,101.84 | 24.53,102.63 26.19,100.97 C1.2 26.35,100.81 26.51,100.81 v26.51,99.85 | 24.53,102.63 28.57,106.68 36.99,106.68 42.7,100.97 C8.2 42.86,100.81 43.02,100.81 v43.02,99.85 | v6.51,32.7 3.81,32.7 3.33,32.23 2.54,32.23 1.43,31.12 C37.2 1.27,30.96 1.11,30.96 1.11,29.69 v1.43,29.37
  Top 0.406: 25.8,43.1 24.76,44.13 IC2.5 | 25.8,43.1 26.99,41.91 C23.2 | 25.8,43.1 v24.61,41.91 | 23.97,37.78 24.76,38.58 IC2.4 IC2.3 | C45.1 11.75,40.32 13.02,39.05 13.02,37.15 IC3.3 11.43,37.31 10.48,37.31 9.84,37.94 6.83,37.94 6.35,38.42 IC3.5 6.35,38.58 v5.71,39.21 | C45.1 18.41,40.32 19.05,40.96 C47.2 19.21,41.12 v20.16,41.12 | 23.97,37.78 20.48,37.78 20.16,38.1 v20.16,39.05 | v24.13,37.78 23.97,37.78 | C22.2 9.84,69.85 9.84,66.67 10,66.67 R23.P$3 9.84,66.52 9.84,64.61 8.1,64.61 5.24,61.75 2.7,61.75 1.75,60.8 1.75,57.94 3.17,57.94 JP1.8 JP1.7 | v10.79,84.3 10,84.3 9.84,84.45 C11.2 | JP1.7 9.52,57.78 12.06,60.33 C15.- 12.22,60.48 12.7,60.96 20.64,60.96 20.8,60.8 SW1.2 20.95,60.64 27.3,60.64 SW1.1 | 8.33,48.82 7.14,50.01 7.14,52.7 JP1.3 JP1.4 JP1.6 JP1.5 JP1.7 | 8.33,48.82 8.73,48.42 10,48.42 12.06,46.36 C16.+ | SW2.2 20.95,53.82 27.3,53.82 SW2.1 | U$4.GND2 27.46,68.1 27.46,67.79 SW0.1 27.3,67.79 20.95,67.79 SW0.2 | C45.1 11.59,40.48 10,42.07 9.21,42.07 4.92,46.36 4.92,48.74 8.25,48.74 8.33,48.82
  Bottom 0.406: C18.2 39.69,48.89 40.64,49.85 40.64,53.02 IC7.1 40.8,53.18 41.27,53.66 v41.27,55.09 | 43.58,46.75 43.66,46.83 43.66,50.64 45.08,52.07 C19.- | 43.58,46.75 v43.18,46.36 | C19.- C21.- 44.93,55.09 v43.81,55.09 | v43.81,53.02 44.93,53.02 C19.- | 43.58,46.75 43.66,46.67 43.66,40.16 v42.7,39.21 42.7,39.05 46.04,35.72 v46.04,27.15 46.04,20 J9.P2 J9.P1 J10.P1 | v22.7,23.97 22.54,23.81 22.54,23.5 | 22.54,23.5 22.54,17.46 J2.P1 | 22.54,23.5 v24.76,23.5 | 43.34,71.12 43.34,66.83 43.18,66.67 R20.P$3 | 43.34,71.12 43.66,71.44 46.35,71.44 SV4.3 | 43.34,71.12 43.18,71.12 43.18,81.12 R14.P$3 43.18,81.44 43.18,95.73 R4.P$3 43.02,96.04 v43.02,99.85 | 26.67,83.66 v27.3,84.3 | 26.67,83.66 26.67,81.28 R15.P$3 | 26.67,83.66 26.51,83.66 26.51,95.73 R12.P$3 26.51,96.04 v26.51,99.85 | C13.2 5.08,42.7 IC4.1 5.56,42.23 5.56,39.53 5.79,39.29 | v6.51,32.7 6.51,38.58 5.79,39.29 | v24.61,41.91 24.61,41.59 IC5.2 26.35,41.59 27.15,40.8 27.15,39.37 25.56,37.78 v24.13,37.78 | C27.2 C26.- 21.75,41.12 v20.16,41.12 v20.16,39.05 | v5.71,39.21 5.79,39.29 | R23.P$3 10,66.67 9.05,67.63 9.05,69.85 8.89,70.01 8.89,80.01 10,81.12 R16.P$3 10.16,81.28 10.16,83.66 v10.79,84.3 10.79,84.45 9.52,85.72 9.52,95.25 10,95.73 R13.P$3 10.16,96.04 10.16,97.31 14.13,101.28 14.13,104.14 16.99,104.14 17.78,104.93 17.78,106.68 U$4.GND | SW2.1 27.46,53.82 28.73,55.09 28.73,59.37 27.46,60.64 SW1.1 27.46,60.8 28.73,62.07 28.73,66.36 27.46,67.63 SW0.1 | J7.P1 1.9,17.78 1.9,26.99 1.43,27.46 v1.43,29.37
  pour Top: 0,0 48.26,0 48.26,0.95 48.26,110.49 45.4,110.49 0,110.49
  pour Bottom: 0,0 48.26,0 48.26,110.49 0,110.49
IN  (via drill 0.3)
  Top 0.203: U$4.13/SCK 30.16,73.34 24.92,73.34 23.02,71.44 22.38,71.44 21.27,70.33 21.27,69.69 20.95,69.69 20.8,69.53 17.78,69.53 16.67,68.42 v12.7,68.42 | v10.79,30.64 10.64,30.48 8.89,30.48 U$1.13
  Bottom 0.203: v12.7,68.42 12.54,68.26 12.54,55.72 10.79,53.97 v10.79,30.64
INL  (via drill 0.3)
  Top 0.203: 46.51,34.61 IC6.1 44.45,34.61 42.86,33.02 U$1.INL | 46.51,34.61 46.67,34.61 46.99,34.92 R41.1 46.51,34.61 | v47.15,37.78 47.15,40.32 C29.2 | 46.51,34.61 v47.15,33.97 | v43.81,74.77 40.48,71.44 v36.35,71.44 | v36.19,61.59 35.4,60.8 v30.48,60.8
  Bottom 0.203: v47.15,33.97 v47.15,37.78 | SV2.3 43.81,76.52 v43.81,74.77 | v36.35,71.44 36.35,67.95 36.04,67.63 36.04,65.25 36.19,65.09 v36.19,61.59 | v30.48,60.8 29.69,60.01 29.69,43.5 30.48,42.7 30.48,34.29 U$1.INL
INR  (via drill 0.3)
  Top 0.203: 36.99,35.88 36.83,35.72 R44.1 36.99,35.88 | IC6.7 36.99,35.88 | 35.88,35.88 35.88,37.94 36.19,38.26 36.51,38.26 36.51,40.32 C31.2 36.67,40.32 v35.72,41.28 | 36.99,35.88 35.88,35.88 | SV2.4 45.24,75.41 34.29,75.41 32.86,73.98 32.86,70.96 31.27,70.96 30.64,70.33 30.64,68.74 35.56,68.74 v35.72,68.9 | U$1.INR 27.94,34.29 32.86,34.29 34.45,35.88 35.88,35.88
  Bottom 0.203: v35.72,68.9 35.56,68.74 35.56,65.09 35.72,64.93 35.72,61.91 35.56,61.75 35.56,55.88 37.15,54.29 37.15,51.91 35.72,50.48 v35.72,41.28
LED_1_G  (via drill 0.3)
  Top 0.203: v24.76,59.06 17.14,59.06 U$4.28
  Bottom 0.203: LED4.1 23.65,69.69 23.65,68.9 24.76,67.79 v24.76,59.06
LED_1_R  (via drill 0.3)
  Top 0.203: v21.11,73.5 21.27,73.5 22.38,72.39 R31.1 | v18.57,64.14 16.67,62.23 U$4.27
  Bottom 0.203: v21.11,73.5 18.57,70.96 v18.57,64.14
LED_2_G
  Top 0.203: LED3.1 26.67,69.22 21.11,69.22 20.95,69.06 18.26,69.06 U$4.25
LED_2_R  (via drill 0.3)
  Top 0.203: v29.21,70.8 27.62,72.39 R30.1 | v29.37,65.09 29.05,64.77 U$4.26
  Bottom 0.203: v29.21,70.8 29.37,70.64 v29.37,65.09
LED_3_G  (via drill 0.3)
  Top 0.203: LED2.1 21.91,74.61 19.84,74.61 v17.62,76.83
  Bottom 0.203: v17.62,76.83 17.62,99.22 U$4.2
LED_3_R  (via drill 0.3)
  Top 0.203: v19.84,78.42 21.43,78.42 22.38,77.47 R28.1
  Bottom 0.203: v19.84,78.42 18.26,76.83 18.26,76.68 17.62,76.04 15.4,76.04 15.4,70.96 U$4.24
LED_4_G  (via drill 0.3)
  Top 0.203: v27.3,91.28 26.51,92.08 17.14,92.08 U$4.5
  Bottom 0.203: LED1.1 27.94,86.84 27.15,87.63 27.15,88.9 27.3,89.06 v27.3,91.28
LED_4_R  (via drill 0.3)
  Top 0.203: v19.53,80.01 24.92,80.01 27.46,77.47 R83.1 | v18.26,84.14 17.3,85.09 U$4.8
  Bottom 0.203: v19.53,80.01 18.26,81.28 v18.26,84.14
LRCLK  (via drill 0.3)
  Top 0.203: U$4.23/A9 30.32,98.9 30.32,96.68 28.26,96.68 27.78,97.16 17.46,97.16 16.67,96.36 13.81,96.36 9.21,91.76 v4.6,91.76 | v5.24,62.71 v3.17,64.77 | v8.41,47.31 11.27,44.45 v16.35,44.45 | v16.83,30.64 16.99,30.48 31.75,30.48 U$1.23
  Bottom 0.203: v4.6,91.76 4.6,83.19 1.59,80.17 1.59,74.61 1.27,74.3 1.27,66.99 3.17,65.09 v3.17,64.77 | v5.24,62.71 8.41,59.53 v8.41,47.31 | v16.35,44.45 16.83,43.97 v16.83,30.64
MCLK  (via drill 0.3)
  Top 0.203: U$4.11/MOSI 5.24,77.47 v3.81,76.04 | v2.22,76.04 0.63,74.45 0.63,42.7 v2.54,42.7
  Bottom 0.203: v2.22,76.04 v3.81,76.04 | v2.54,42.7 3.49,41.75 3.49,28.73 10.16,22.07 U$1.11
MEMCS  (via drill 0.3)
  Top 0.203: U$4.6 16.99,90.65 30.64,90.65 31.27,91.28 v33.81,91.28 | v36.67,80.33 39.37,77.63 v41.27,77.63 | v42.54,68.1 42.7,67.95 44.29,67.95 44.45,67.79 v44.45,65.41 | v36.19,56.52 35.88,56.2 v33.18,56.2
  Bottom 0.203: v33.81,91.28 34.29,90.8 34.29,87.15 36.67,84.77 v36.67,80.33 | v41.27,77.63 42.54,76.36 v42.54,68.1 | v44.45,65.41 37.31,65.41 37.31,61.59 36.19,60.48 v36.19,56.52 | v33.18,56.2 32.86,55.88 32.86,30.8 31.75,29.69 31.75,26.83 26.67,21.75 26.67,12.86 24.61,10.79 22.86,10.79 U$1.6
MISO  (via drill 0.3)
  Top 0.203: U$4.12/MISO 15.87,75.56 11.59,75.56 v1.75,65.72
  Bottom 0.203: v1.75,65.72 1.9,65.56 1.9,42.55 2.7,41.75 2.7,33.34 3.02,33.02 3.02,28.58 7.62,23.97 U$1.12
MORPH_IN
  Top 0.203: C53.1 31.75,26.19 31.91,26.04 J1.P3 36.67,26.04 36.83,26.19 R64.2
MORPH_IN1
  Top 0.203: C6.1 21.59,26.19 21.75,26.04 J2.P3 26.51,26.04 26.67,26.19 R1.2
MORPH_IN2
  Top 0.203: R5.2 31.75,1.75 31.91,1.91 J3.P3 36.67,1.91 36.83,1.75 C9.1
MORPH_IN3
  Top 0.203: R8.2 21.59,1.75 21.75,1.91 J4.P3 26.51,1.91 26.67,1.75 C12.1
MORPH_IN4
  Top 0.203: C30.1 41.27,26.19 41.43,26.04 J9.P3 46.83,26.04 46.99,26.19 R40.2
MORPH_IN5
  Top 0.203: R43.2 40.64,1.75 40.8,1.91 J10.P3 47.15,1.91 47.31,1.75 C32.1
MOSI  (via drill 0.3)
  Top 0.203: U$4.7 17.46,86.68 29.84,86.68 v30,86.84 | v26.03,62.39 24.92,61.28 v24.13,61.28 | v24.45,46.83 24.13,46.51 19.21,46.51 13.65,40.96 v12.7,40.96 | v12.54,18.1 13.49,17.14 17.14,17.14 U$1.7
  Bottom 0.203: v30,86.84 28.89,85.72 28.89,72.87 26.35,70.33 26.35,68.42 26.03,68.1 v26.03,62.39 | v24.13,61.28 24.13,53.5 24.45,53.18 v24.45,46.83 | v12.7,40.96 12.38,40.64 12.38,30.64 11.43,29.69 11.43,19.21 v12.54,18.1
N$1  (via drill 0.3)
  Top 0.203: R2.2 44.93,49.21 44.93,50.01 45.72,50.8 IC1.6 45.72,52.86 v46.35,52.86 | v40.96,27.78 29.84,27.78 26.67,24.61 R1.1 | v42.07,42.86 43.97,44.77 R3.1 44.93,44.77 44.93,45.88 | 44.93,45.88 44.93,46.99 C4.1 | 44.93,45.88 v46.2,45.88
  Bottom 0.203: v40.96,27.78 42.07,28.89 v42.07,42.86 | v46.35,52.86 46.2,52.7 v46.2,45.88
N$2  (via drill 0.3)
  Top 0.203: 44.93,61.28 44.93,63.5 R7.1 | v33.81,3.81 32.07,3.81 31.75,3.49 R5.1 | v42.54,58.1 43.5,59.06 R6.2 44.93,59.06 | 44.93,59.06 44.93,61.28 | 44.93,61.28 C7.1 | IC1.9 45.72,59.06 44.93,59.06
  Bottom 0.203: v33.81,3.81 39.37,9.37 39.37,45.4 42.54,48.58 v42.54,58.1
N$3  (via drill 0.3)
  Top 0.203: 41.59,61.28 41.59,59.06 R9.2 41.43,59.06 41.43,57.94 40.64,57.15 IC1.13 40.64,55.88 v39.69,54.93 | 41.59,61.28 41.59,63.5 R10.1 | 41.59,61.28 C10.1 | v24.76,4.92 23.02,4.92 21.59,3.49 R8.1 | v36.35,50.32 39.21,53.18 v39.53,53.18
  Bottom 0.203: v24.76,4.92 31.75,11.91 31.75,26.19 34.29,28.73 34.29,34.13 36.35,36.2 v36.35,50.32 | v39.53,53.18 39.69,53.34 v39.69,54.93
N$4
  Top 0.203: 1.27,38.58 0.32,38.58 0.32,35.24 1.27,34.29 R17.1 | 1.27,38.58 3.81,38.58 | 1.27,38.58 R18.2 | 3.81,38.58 4.6,37.78 5.56,37.78 6.19,37.15 IC3.6 | 3.81,38.58 C14.1
N$5
  Top 0.406: D3.A 6.98,60.33 JP1.9 JP1.10
N$6  (via drill 0.3)
  Top 0.203: v1.27,22.38 R19.2 | v0.95,35.88 0.95,36.83 1.27,36.83 R18.1 1.27,36.99 3.81,36.99 C14.2 3.81,36.83 4.13,36.51 5.56,36.51 6.19,35.88 IC3.7
  Bottom 0.203: v1.27,22.38 0.79,22.86 0.79,35.72 v0.95,35.88
N$7  (via drill 0.3)
  Top 0.406: v5.56,47.31 6.03,47.31 D4.C | JP1.1 JP1.2
  Bottom 0.406: v5.56,47.31 5.71,47.47 JP1.1
N$8
  Top 0.203: J8.P3 1.43,1.91 1.27,1.75 R19.1
N$10  (via drill 0.3)
  Top 0.203: SV2.1 44.93,85.57 32.86,85.57 32.23,86.2 v15.87,86.2 | v10.16,61.59 v14.92,66.36 | v10.16,31.43 10.32,31.27 24.13,31.27 25.4,32.54 25.4,34.29 27.3,34.29 28.57,35.56 U$1.INGND1
  Bottom 0.203: v15.87,86.2 14.76,85.09 14.76,66.52 v14.92,66.36 | v10.16,31.43 v10.16,61.59
N$11  (via drill 0.3)
  Top 0.203: 41.59,46.99 41.59,49.21 C40.1 41.43,49.21 40.8,49.85 40.64,49.85 IC1.2 | v35.88,25.4 36.04,25.4 36.83,24.61 R64.1 | v37.31,42.23 38.26,43.18 40.8,43.18 41.43,43.81 41.43,44.77 R70.1 41.59,44.77 41.59,46.99 | 41.59,46.99 R57.2
  Bottom 0.203: v35.88,25.4 36.83,26.35 36.83,41.75 v37.31,42.23
N$12  (via drill 0.3)
  Top 0.406: v12.38,53.82 10.32,53.82 10.16,53.97 L6.2 | v12.38,43.81 13.02,43.18 D4.A
  Bottom 0.406: v12.38,43.81 v12.38,53.82
N$14  (via drill 0.3)
  Top 0.203: v14.6,4.92 11.59,4.92 10.16,3.49 R25.1 | v22.86,34.77 22.86,37.15 25.4,37.15 | 25.4,37.15 26.03,37.15 26.67,37.78 R26.2 26.67,37.94 29.21,37.94 | 29.21,37.94 31.75,37.94 R27.1 | 29.21,37.94 C38.1 | 25.4,37.15 25.4,40.64 25.24,40.8 22.7,40.8 22.22,40.32 IC2.2
  Bottom 0.203: v14.6,4.92 19.05,9.37 19.05,20.32 21.27,22.54 21.27,28.42 21.59,28.73 21.59,31.27 22.86,32.54 v22.86,34.77
N$15  (via drill 0.3)
  Top 0.203: SV2.2 41.59,76.83 v41.27,76.83 | v37.46,72.07 v38.73,73.34 | v36.67,65.56 35.24,64.14 32.7,64.14 31.91,63.34 31.27,63.34 28.73,60.8 28.73,59.37 25.24,59.37 24.92,59.69 v22.86,59.69
  Bottom 0.203: v41.27,76.83 38.73,74.3 v38.73,73.34 | v37.46,72.07 36.99,71.6 36.99,67.95 36.67,67.63 v36.67,65.56 | v22.86,59.69 22.86,49.37 20.64,47.15 18.89,47.15 18.89,39.21 21.27,36.83 26.67,36.83 U$1.INGND2
N$16
  Top 0.203: R40.1 46.99,24.61 47.94,25.56 47.94,36.67 46.99,36.67 R41.2 | 46.51,37.15 46.51,36.83 46.99,36.83 R41.2 | 46.51,37.15 46.51,38.26 45.72,39.05 45.56,39.05 45.56,40.32 C29.1 | 46.51,37.15 IC6.3 | 46.51,37.15 R41.2
N$17
  Top 0.203: LED2.2 20.64,75.56 20.64,77.47 R28.2
N$18
  Top 0.406: J5.P2 16.35,18.41 16.51,18.26 R39.1
N$19
  Top 0.203: LED3.2 25.72,70.48 25.72,72.39 R30.2
N$20
  Top 0.203: LED4.2 20.64,70.48 20.64,72.39 R31.2
N$21  (via drill 0.3)
  Top 0.203: C31.1 38.26,40.32 36.99,39.05 36.99,37.47 36.83,37.47 R44.2 36.83,37.31 36.99,37.15 IC6.6 40,37.15 v42.7,34.45 | v42.7,5.56 40.64,3.49 R43.1
  Bottom 0.203: v42.7,34.45 v42.7,5.56
N$24
  Top 0.406: J3.P2 31.91,9.53 31.75,9.68 R33.1
N$25
  Top 0.203: J2.P2 26.51,18.41 26.67,18.26 R32.1
N$26
  Top 0.203: J1.P2 36.67,18.41 36.83,18.26 R24.1
N$27
  Top 0.406: J4.P2 21.75,9.53 21.59,9.68 R35.1
N$30  (via drill 0.3)
  Top 0.203: 29.21,44.29 26.67,44.29 R34.2 | 29.21,44.29 30.96,44.29 | 30.96,44.29 31.75,44.29 R29.1 | 29.21,44.29 C48.1 | v17.62,27.3 15.08,24.77 10.95,24.77 10.79,24.61 R38.1 | v17.46,42.86 20.64,46.04 21.27,46.04 21.59,45.72 21.59,43.02 22.7,43.02 23.49,43.81 IC2.6 | v30.96,43.02 30.96,44.29 | v24.76,24.29 23.18,22.7 v20.64,22.7
  Bottom 0.203: v17.46,42.86 17.46,31.75 19.05,30.16 19.05,28.73 v17.62,27.3 17.62,25.72 v20.64,22.7 | v30.96,43.02 30.96,31.43 29.21,29.69 29.21,28.73 v24.76,24.29
N$31
  Top 0.406: J6.P2 11.59,9.53 11.43,9.68 R47.1
N$40  (via drill 0.3)
  Top 0.203: v15.24,62.23 D3.C | L5.2 13.97,54.13 v15.24,55.4 13.33,55.4 13.33,56.36 15.24,58.26 27.15,58.26 29.37,56.04 30.64,56.04 | v17.46,48.1 17.14,48.42 v15.87,48.42 | v35.72,54.93 35.08,55.56 32.38,55.56 31.91,56.04 30.64,56.04 | v43.18,53.82 32.54,53.82 32.23,53.5 31.27,53.5 30.64,54.13 30.64,56.04
  Bottom 0.203: v15.24,62.23 v15.24,55.4 15.24,49.05 v15.87,48.42 | v17.46,48.1 17.46,46.83 17.94,46.36 L1.2 | v35.72,54.93 35.72,53.5 36.04,53.18 IC7.3 | v43.18,53.82 43.18,56.36 44.45,57.63 44.45,59.06 45.08,59.69 C21.+
N$42  (via drill 0.3)
  Top 0.203: v23.18,48.1 v25.08,48.1
  Bottom 0.203: 21.91,46.36 L1.1 | C27.1 21.91,46.36 | v25.08,48.1 25.08,43.97 25.88,43.18 IC5.3 | v23.18,48.1 21.91,46.83 21.91,46.36
N$44
  Top 0.203: LED1.2 25.72,75.56 25.72,77.47 R83.2
N$62
  Top 0.203: IC3.2 13.81,35.88 13.97,36.04 C42.1 | 14.29,36.2 14.29,38.42 R21.1 | 14.29,36.2 13.97,36.2 C42.1 | 14.29,36.2 16.51,36.2 R22.2 | 14.29,36.2 C42.1
N$63  (via drill 0.3)
  Top 0.203: v2.38,27.46 1.27,26.35 R46.2 | v2.38,32.86 2.86,33.34 10.16,33.34 11.43,34.61 IC3.1 13.81,34.61 13.97,34.45 | 13.97,34.45 16.51,34.45 R22.1 | 13.97,34.45 C42.2
  Bottom 0.203: v2.38,32.86 v2.38,27.46
N$65
  Top 0.203: J7.P3 2.7,26.04 1.27,24.61 R46.1
NORMALIZATION_PROBE  (via drill 0.3)
  Top 0.203: 21.59,8.1 11.43,8.1 R47.2 | 21.59,8.1 31.75,8.1 | 21.59,8.1 R35.2 | 26.67,20 16.51,20 | 26.67,20 36.83,20 | 26.67,20 R32.2 | 37.78,20 37.78,24.29 40.64,27.15 42.86,27.15 D1.3 | 36.83,20 37.78,20 | 36.83,20 R24.2 | U$4.32/A13 16.03,49.05 v13.97,49.05 | 16.51,20 v15.56,20.96 | 16.51,20 R39.2 | 31.75,8.1 31.91,8.26 38.58,8.26 45.72,15.4 45.72,17.14 40.64,17.14 37.78,20 | 31.75,8.1 R33.2
  Bottom 0.203: v13.97,49.05 13.81,48.89 13.81,29.84 13.97,29.69 13.97,27.78 15.56,26.19 v15.56,20.96
OUT  (via drill 0.3)
  Top 0.203: U$4.22/A8 31.75,96.36 31.27,96.36 30.64,95.73 30.64,93.82 32.23,93.82 34.45,91.6 34.45,89.06 32.86,87.47 32.86,86.68 v32.54,86.68 | v30.48,79.53 28.42,77.47 28.42,76.52 27.46,76.52 26.35,75.41 26.35,74.61 24.92,74.61 23.81,75.72 23.81,79.06 17.14,79.06 16.67,78.58 5.56,78.58 1.11,74.14 1.11,43.34 3.65,43.34 6.51,40.48 v7.3,40.48 | v8.89,24.92 10.16,23.65 13.49,23.65 14.13,24.29 18.1,24.29 21.75,27.94 29.21,27.94 U$1.22
  Bottom 0.203: v32.54,86.68 32.07,86.2 30.96,86.2 30.96,85.88 30.48,85.41 v30.48,79.53 | v7.3,40.48 7.78,40 7.78,30.8 8.89,29.69 v8.89,24.92
OUTL
  Top 0.203: U$1.OUTL 17.78,33.02 17.78,36.83 16.19,38.42 R21.2
OUTR  (via drill 0.3)
  Top 0.203: v21.91,23.34 13.81,23.34 13.33,22.86 10.64,22.86 10.48,23.02 0.32,23.02 0.32,31.59 3.02,34.29 R17.2
  Bottom 0.203: v21.91,23.34 21.91,26.51 24.13,28.73 U$1.OUTR
POT1
  Top 0.203: U$4.21/A7 33.97,97.47 | 33.97,97.47 34.45,97.95 37.94,97.95 40.96,100.97 C8.1 | 33.97,97.47 36.83,94.61 39.53,94.61 40.64,95.73 R4.P$2
POT2  (via drill 0.3)
  Top 0.203: v24.45,99.54 24.45,100.97 C1.1
  Bottom 0.203: R12.P$2 24.13,99.22 v24.45,99.54 24.45,100.49 26.67,100.49 27.94,99.22 27.94,92.71 U$4.20/A6
POT3
  Top 0.203: 7.94,98.9 7.94,95.88 7.62,95.88 R13.P$2 | 7.94,98.9 7.94,100.97 C2.1 | U$4.A10 28.1,98.9 7.94,98.9
POT4
  Top 0.203: 40.96,84.45 40.96,81.28 R14.P$2 | U$4.17/A3 32.38,84.45 40.96,84.45 | 40.96,84.45 C3.1
POT5  (via drill 0.3)
  Top 0.203: v23.49,84.14 24.13,84.14 24.45,84.45 C5.1 | U$4.34/A15 31.43,52.39 v22.22,52.39 | v22.22,68.42 22.38,68.58 v24.76,68.58
  Bottom 0.203: v23.49,84.14 24.13,83.5 R15.P$2 24.13,69.22 v24.76,68.58 | v22.22,68.42 v22.22,52.39
POT6  (via drill 0.3)
  Top 0.203: v7.94,83.19 7.94,84.45 C11.1 | U$4.16/A2 18.1,82.55 16.67,81.12 12.38,81.12 11.27,80.01 8.73,80.01 7.62,81.12 R16.P$2
  Bottom 0.203: v7.94,83.19 7.62,82.87 R16.P$2
POT7  (via drill 0.3)
  Top 0.203: v40,68.9 40.64,69.53 | 40.64,69.53 40.96,69.85 C20.1 40.64,69.53 | v35.08,64.77 U$4.39/A20 | v35.08,69.37 35.24,69.53 40.64,69.53
  Bottom 0.203: v40,68.9 40.64,68.26 R20.P$2 | v35.08,69.37 v35.08,64.77
POT8  (via drill 0.3)
  Top 0.203: R23.P$2 7.62,66.67 7.94,66.67 7.94,69.85 C22.1 8.1,69.85 v10.16,71.91 | U$4.A11 27.78,93.82 v14.29,93.82
  Bottom 0.203: v14.29,93.82 12.7,92.23 12.7,90.96 10.64,88.9 10.64,86.04 11.91,84.77 11.91,75.56 10.16,73.82 v10.16,71.91
RX
  Bottom 0.203: U$4.0/RX 4.6,105.41 4.6,97.95 SV1.2
SCK  (via drill 0.3)
  Top 0.203: U$4.14/A0 33.18,78.9 33.18,83.66 26.99,83.66 26.83,83.5 17.14,83.5 16.99,83.66 10.48,83.66 9.37,82.55 v0.48,82.55 | v0.95,42.07 3.17,39.85 v8.41,39.85
  Bottom 0.203: v0.48,82.55 0.32,82.39 0.32,42.7 v0.95,42.07 | v8.41,39.85 9.52,38.73 9.52,29.84 U$1.14
SCL  (via drill 0.3)
  Top 0.203: U$4.19/A5/SCL 31.43,89.85 17.78,89.85 16.67,88.74 15.08,88.74 11.75,85.41 v3.02,85.41 | v1.75,30 3.81,27.94 21.11,27.94 22.38,29.21 U$1.19
  Bottom 0.203: v3.02,85.41 1.11,83.5 1.11,74.77 0.79,74.45 0.79,43.02 1.75,42.07 v1.75,30
SDA  (via drill 0.3)
  Top 0.203: v29.84,76.83 28.89,75.88 28.89,74.14 19.84,74.14 16.67,70.96 v13.65,70.96 | v13.18,47.94 15.87,45.24 v16.35,45.24
  Bottom 0.203: U$4.18/A4/SDA 29.84,85.72 v29.84,76.83 | v13.65,70.96 13.33,70.64 13.33,55.09 13.65,54.77 13.65,49.53 13.18,49.05 v13.18,47.94 | v16.35,45.24 18.41,43.18 18.41,37.94 20.32,36.04 U$1.18
SDCS  (via drill 0.3)
  Top 0.203: U$4.10/CS 15.56,79.06 v4.6,79.06
  Bottom 0.203: v4.6,79.06 4.6,68.58 3.81,67.79 3.81,61.59 4.44,60.96 4.44,46.83 4.13,46.51 4.13,35.4 5.87,33.66 5.87,26.99 10.64,22.23 10.64,16.03 U$1.10
SW_0  (via drill 0.3)
  Top 0.203: U$4.29 16.99,57.63 v18.57,57.63 | SW0.3 27.3,63.18 20.95,63.18 SW0.4
  Bottom 0.203: v18.57,57.63 19.53,58.58 19.53,61.75 20.8,63.02 SW0.4
SW_1
  Top 0.203: U$4.30 17.94,56.04 20.8,56.04 SW1.4 20.95,56.2 27.3,56.2 SW1.3
SW_2  (via drill 0.3)
  Top 0.203: v13.97,56.2 14.13,56.04 v17.14,56.04 | v18.57,50.16 19.53,49.21 20.8,49.21 SW2.4 20.95,49.21 27.3,49.21 SW2.3
  Bottom 0.203: U$4.4/CANRX 14.29,93.03 14.29,64.77 13.97,64.45 v13.97,56.2 | v17.14,56.04 18.57,54.61 v18.57,50.16
TX  (via drill 0.3)
  Top 0.203: v11.59,94.93 9.37,92.71 SV1.1
  Bottom 0.203: U$4.1/TX 11.59,97.95 v11.59,94.93
V_OCT_IN  (via drill 0.3)
  Top 0.203: v12.38,21.59 10.79,20 C60.1 | J5.P3 10.95,26.04 10.79,26.19 R38.2
  Bottom 0.203: v12.38,21.59 12.54,21.75 12.54,24.61 J5.P3
VCC  (via drill 0.3)
  Top 0.406: v4.76,33.97 5.4,34.61 IC3.8 | C37.1 3.17,31.12 v4.13,32.07 v11.43,32.07 | v13.02,52.55 13.97,52.55 L5.1 14.13,52.39 15.72,50.8 v34.45,50.8 | v13.02,54.61 13.02,54.93 12.06,55.88 C15.+ | v33.5,40.64 30.16,40.64 28.89,41.91 C23.1 | v34.61,35.24 35.24,34.61 IC6.8 | SV3.2 45.88,97.31 v36.99,97.31 | v34.45,80.17 v37.62,83.34 | v34.45,74.77 34.13,74.45 34.13,70.8 v34.45,70.8
  Bottom 0.406: v4.13,32.07 4.76,32.7 v4.76,33.97 | v13.02,52.55 v13.02,54.61 12.86,54.45 12.06,54.45 11.75,54.13 11.75,32.39 v11.43,32.07 | 34.37,39.77 34.61,39.53 v34.61,35.24 | 34.37,39.77 v33.5,40.64 | v36.99,97.31 36.67,97 36.67,90.01 37.62,89.06 v37.62,83.34 | v34.45,74.77 v34.45,80.17 | v34.45,70.8 v34.45,50.8 34.45,39.85 34.37,39.77
VEE  (via drill 0.3)
  Top 0.406: IC6.4 44.45,38.42 44.45,38.73 42.86,40.32 C25.2 42.7,40.48 41.59,41.59 36.83,41.59 v33.81,44.61 | IC3.4 11.75,38.42 11.75,38.58 10,40.32 C45.2 9.84,40.48 v9.05,41.28 | 10.16,50.32 L6.1 | 10.16,50.32 12.06,50.32 C16.- 11.91,50.16 14.6,47.47 31.91,47.47 v33.5,45.88 | v9.05,49.05 10.16,50.16 10.16,50.32 | SV3.4 40.8,86.2 v34.45,86.2
  Bottom 0.406: 9.05,46.04 7.62,46.04 R11.1 | v9.05,49.05 9.05,46.04 | 9.05,46.04 v9.05,41.28 | v33.5,45.88 33.5,44.93 v33.81,44.61 33.81,85.57 v34.45,86.2